# Altium schematic sheet Relay_Conn.SchDoc
size A4; Organization: Altium Limited; Address1: L3, 12a Rodborough Rd; Address2: Frenchs Forest; Address3: NSW; Address4: Australia 2086
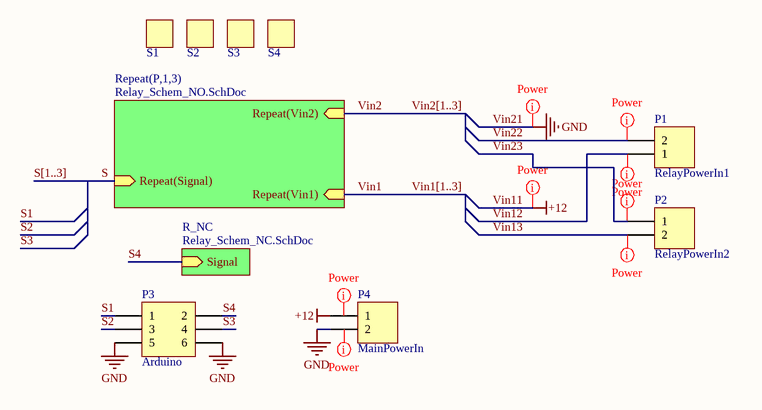
[diagram p0: Relay_Conn.SchDoc]

## Parts
P1  RelayPowerIn1  [CONN-WAFER-2x1]
P2  RelayPowerIn2  [CONN-WAFER-2x1]
P3  Arduino  [CONN-IDC-HARTING-2x3]
P4  MainPowerIn  [CONN-WAFER-2x1]
S1  SCREW  [MECH-SCREW-M2.3]  (value not drawn)
S2  SCREW  [MECH-SCREW-M2.3]  (value not drawn)
S3  SCREW  [MECH-SCREW-M2.3]  (value not drawn)
S4  SCREW  [MECH-SCREW-M2.3]  (value not drawn)

## Sub-sheets
R_NC = Relay_Schem_NC.SchDoc: Signal (in)
Repeat(P,1,3) = Relay_Schem_NO.SchDoc: Repeat(Signal) (in), Repeat(Vin2) (in), Repeat(Vin1) (in)

## Nets
Vin11: P4.1  [also labelled +12]
Vin21: P3.5 P3.6 P4.2  [also labelled GND]
S: sheet Repeat(P,1,3)/Repeat(Signal)
S1: P3.1
S2: P3.3
S3: P3.4
S4: P3.2 ; sheet R_NC/Signal
Vin1: sheet Repeat(P,1,3)/Repeat(Vin1)
Vin2: sheet Repeat(P,1,3)/Repeat(Vin2)
Vin12: P1.1
Vin13: P2.2
Vin22: P1.2
Vin23: P2.1

## Buses and harness runs
bus S[1..3]
bus Vin1[1..3]
bus Vin2[1..3]

## Layout directives
net class Power: (no net found under the mark), Vin11, Vin12, Vin13, Vin21, Vin22, Vin23

## Notes on the sheet
- Title
- Size:
- Date:
- A4
- Number:
- Time:
- Revision:
- Sheet
- of
- File:

## Library data of the parts
P1 P2 P4 = Header 2: Header, 2-Pin; LatestRevisionDate: 17-Jul-2002; LatestRevisionNote: Re-released for DXP Platform.; Publisher: Altium Limited
P3 = Header 3X2: Header, 3-Pin, Dual row; LatestRevisionDate: 17-Jul-2002; LatestRevisionNote: Re-released for DXP Platform.; Publisher: Altium Limited
S1-S4 = SCREW: Screw to add to schematics in order for them not to be removed from PCB